# Altium schematic sheet [03] - USB-C TO DISPLAYPORT.SchDoc
size A3; DocumentNumber: 3; SheetNumber: 3; SheetTotal: 5
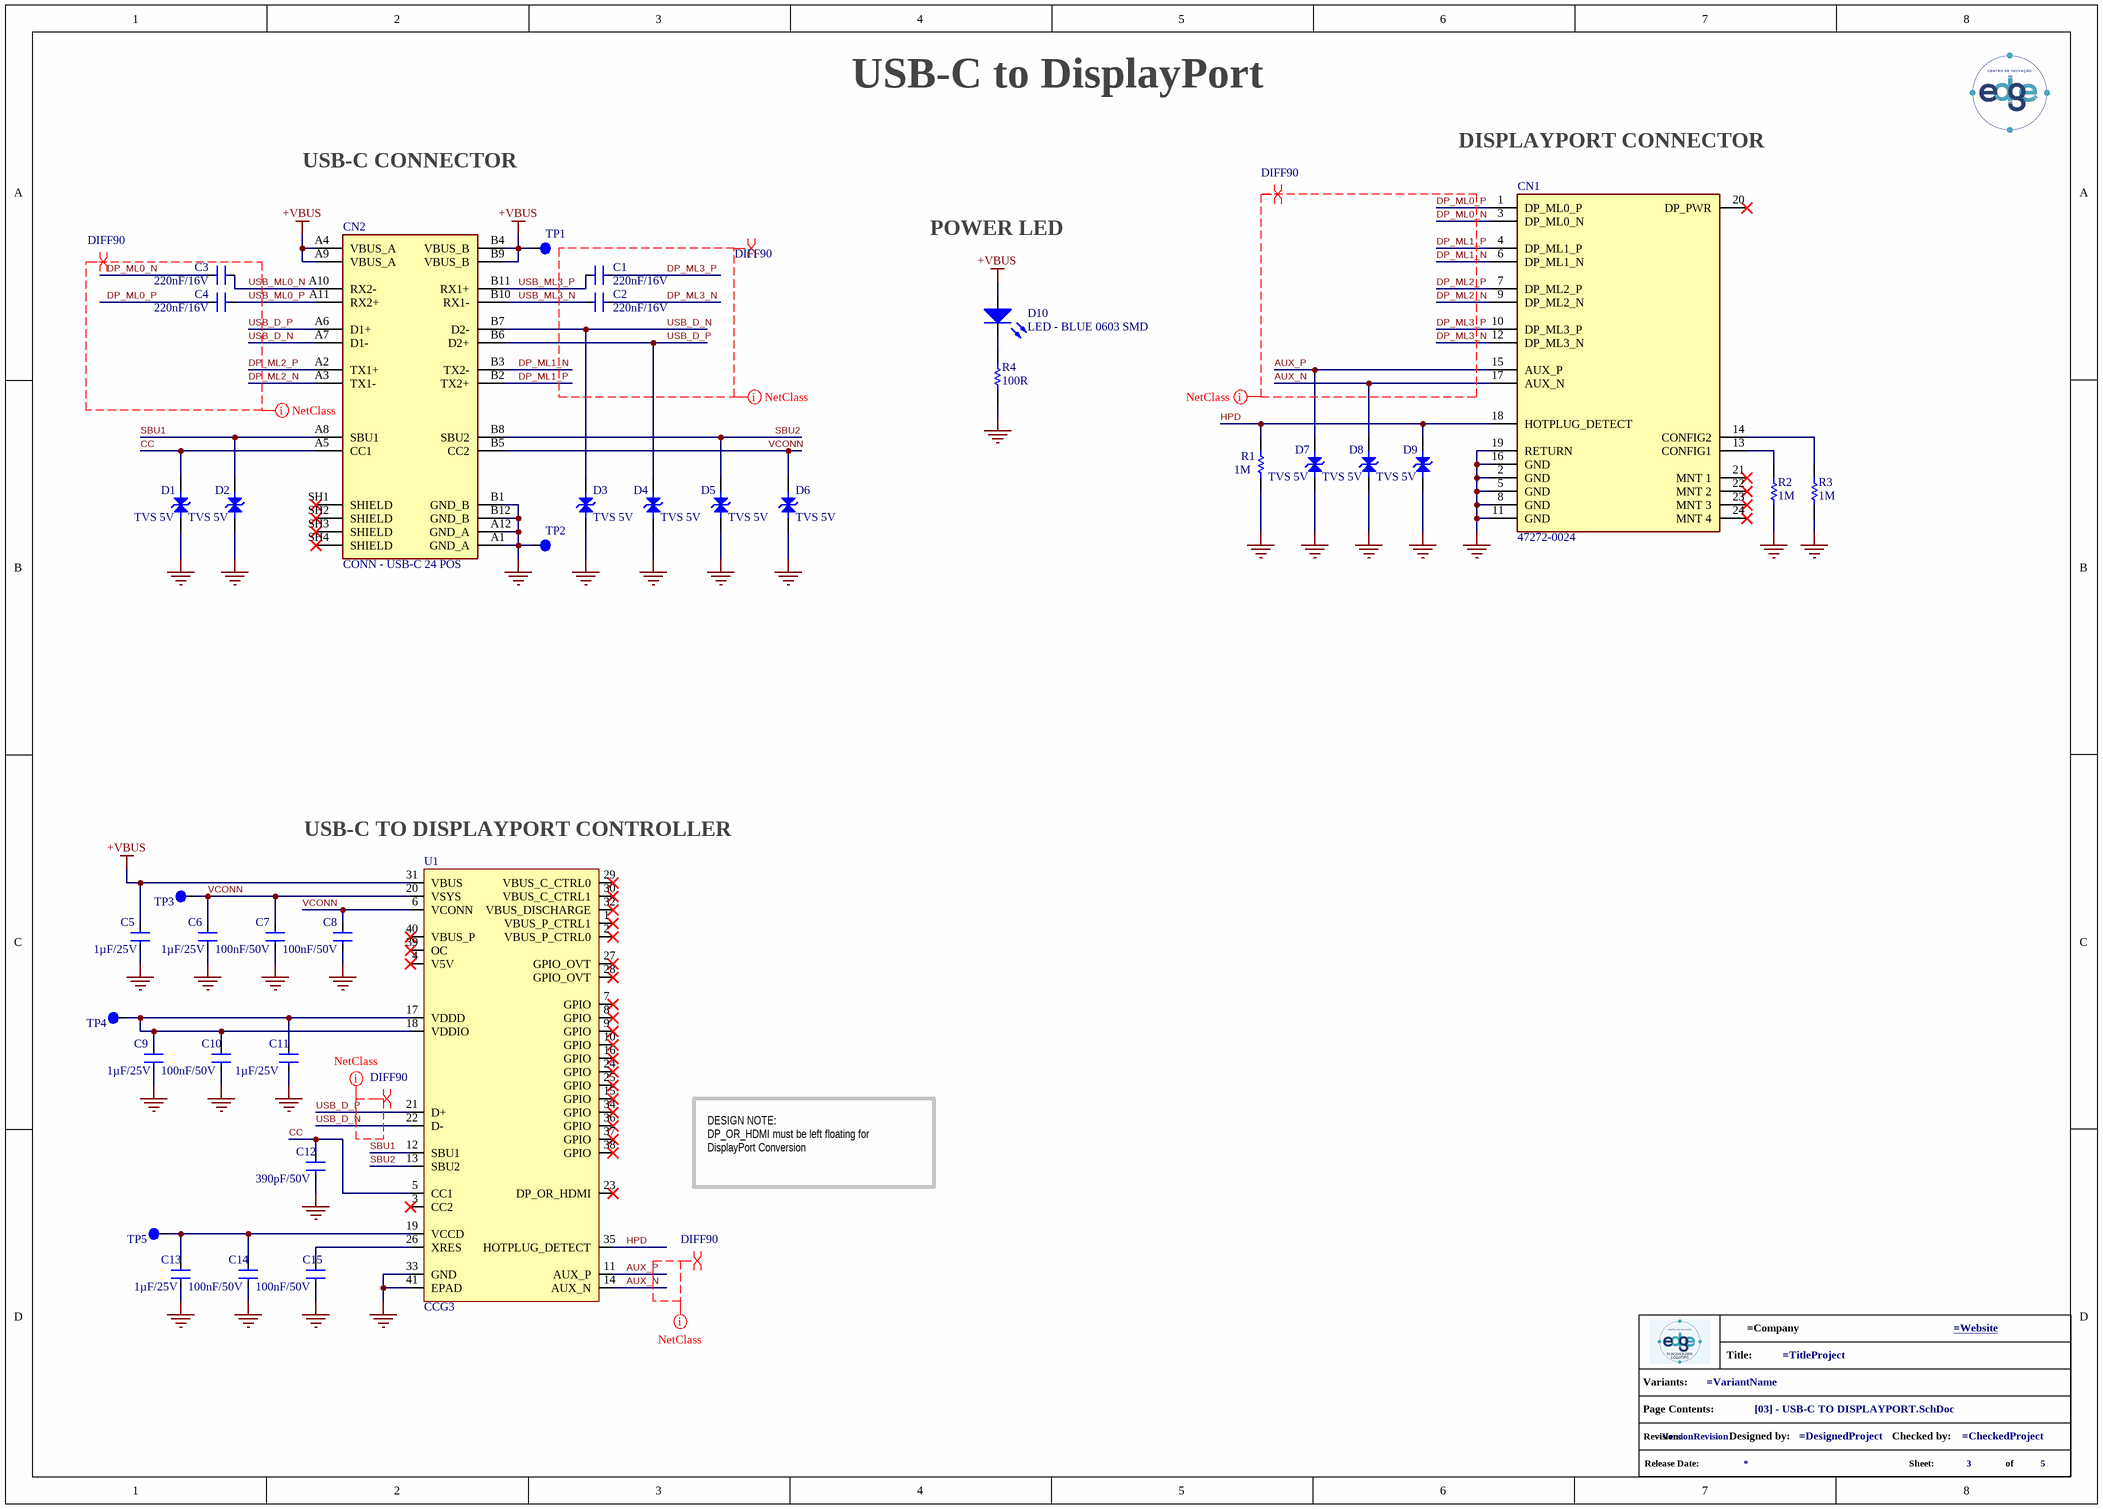
[diagram p0: [03] - USB-C TO DISPLAYPORT.SchDoc]

## Parts
*?  info_project  (value not drawn)  (graphical)
C1  220nF/16V  [C0402]
C2  220nF/16V  [C0402]
C3  220nF/16V  [C0402]
C4  220nF/16V  [C0402]
C5  1µF/25V  [C0402]
C6  1µF/25V  [C0402]
C7  100nF/50V  [C0402]
C8  100nF/50V  [C0402]
C9  1µF/25V  [C0402]
C10  100nF/50V  [C0402]
C11  1µF/25V  [C0402]
C12  390pF/50V  [C0402]
C13  1µF/25V  [C0402]
C14  100nF/50V  [C0402]
C15  100nF/50V  [C0402]
CN1  47272-0024  [FP-47272-0024-MFG]
CN2  CONN - USB-C 24 POS  [AMPHENOL_12401945E212A]
D1  TVS 5V  [STN161050U852]
D2  TVS 5V  [STN161050U852]
D3  TVS 5V  [STN161050U852]
D4  TVS 5V  [STN161050U852]
D5  TVS 5V  [STN161050U852]
D6  TVS 5V  [STN161050U852]
D7  TVS 5V  [STN161050U852]
D8  TVS 5V  [STN161050U852]
D9  TVS 5V  [STN161050U852]
D10  LED - BLUE 0603 SMD  [BLUE LED]
R1  1M  [R0402]
R2  1M  [R0402]
R3  1M  [R0402]
R4  100R  [R0402]
TP1  TestPoint  [Test Point]  (value not drawn)  (no BOM)
TP2  TestPoint  [Test Point]  (value not drawn)  (no BOM)
TP3  TestPoint  [Test Point]  (value not drawn)  (no BOM)
TP4  TestPoint  [Test Point]  (value not drawn)  (no BOM)
TP5  TestPoint  [Test Point]  (value not drawn)  (no BOM)
U1  CCG3  [QFN50P600X600X60_HS-41N]

## Nets
+VBUS: C5.2 CN2.A4(VBUS_A) CN2.A9(VBUS_A) CN2.B4(VBUS_B) CN2.B9(VBUS_B) D10.2(A) TP1.1 U1.31(VBUS)
GND: C5.1 C6.1 C7.1 C8.1 C9.1 C10.1 C11.1 C12.1 C13.1 C14.1 C15.1 CN1.2(GND) CN1.5(GND) CN1.8(GND) CN1.11(GND) CN1.16(GND) CN1.19(RETURN) CN2.A1(GND_A) CN2.A12(GND_A) CN2.B1(GND_B) CN2.B12(GND_B) D1.1 D2.1 D3.1 D4.1 D5.1 D6.1 D7.1 D8.1 D9.1 R1.1 R2.2 R3.2 R4.1 TP2.1 U1.33(GND) U1.41(EPAD)
AUX_N: CN1.17(AUX_N) D8.2 U1.14(AUX_N)
AUX_P: CN1.15(AUX_P) D7.2 U1.11(AUX_P)
CC: C12.2 CN2.A5(CC1) D1.2 U1.5(CC1)
DP_ML0_N: C3.1 CN1.3(DP_ML0_N)
DP_ML0_P: C4.1 CN1.1(DP_ML0_P)
DP_ML1_N: CN1.6(DP_ML1_N) CN2.B3(TX2-)
DP_ML1_P: CN1.4(DP_ML1_P) CN2.B2(TX2+)
DP_ML2_N: CN1.9(DP_ML2_N) CN2.A3(TX1-)
DP_ML2_P: CN1.7(DP_ML2_P) CN2.A2(TX1+)
DP_ML3_N: C2.2 CN1.12(DP_ML3_N)
DP_ML3_P: C1.2 CN1.10(DP_ML3_P)
HPD: CN1.18(HOTPLUG_DETECT) D9.2 R1.2 U1.35(HOTPLUG_DETECT)
SBU1: CN2.A8(SBU1) D2.2 U1.12(SBU1)
SBU2: CN2.B8(SBU2) D5.2 U1.13(SBU2)
USB_D_N: CN2.A7(D1-) CN2.B7(D2-) D3.2 U1.22(D-)
USB_D_P: CN2.A6(D1+) CN2.B6(D2+) D4.2 U1.21(D+)
USB_ML0_N: C3.2 CN2.A10(RX2-)
USB_ML0_P: C4.2 CN2.A11(RX2+)
USB_ML3_N: C2.1 CN2.B10(RX1-)
USB_ML3_P: C1.1 CN2.B11(RX1+)
VCONN: C6.2 C7.2 C8.2 CN2.B5(CC2) D6.2 TP3.1 U1.6(VCONN) U1.20(VSYS)
NetC9_2: C9.2 C10.2 C11.2 TP4.1 U1.17(VDDD) U1.18(VDDIO)
NetC13_2: C13.2 C14.2 TP5.1 U1.19(VCCD)
NetC15_2: C15.2 U1.26(XRES)
NetCN1_13: CN1.13(CONFIG1) R2.1
NetCN1_14: CN1.14(CONFIG2) R3.1
NetD10_1: D10.1(K) R4.2

Not connected (* = marked no-connect by the designer): CN1 20(DP_PWR)* 21(MNT_1)* 22(MNT_2)* 23(MNT_3)* 24(MNT_4)*; CN2 SH1(SHIELD)* SH2(SHIELD)* SH3(SHIELD)* SH4(SHIELD)*; U1 1(VBUS_P_CTRL1)* 2(VBUS_P_CTRL0)* 3(CC2)* 4(V5V)* 7(GPIO)* 8(GPIO)* 9(GPIO)* 10(GPIO)* 15(GPIO)* 16(GPIO)* 23(DP_OR_HDMI)* 24(GPIO)* 25(GPIO)* 27(GPIO_OVT)* 28(GPIO_OVT)* 29(VBUS_C_CTRL0)* 30(VBUS_C_CTRL1)* 32(VBUS_DISCHARGE)* 34(GPIO)* 36(GPIO)* 37(GPIO)* 38(GPIO)* 39(OC)* 40(VBUS_P)*

## Layout directives
differential pair; differential pair class DIFF90: (no net found under the mark), AUX_N, AUX_P, DP_ML0_N, DP_ML0_P, DP_ML1_N, DP_ML1_P, DP_ML2_N, DP_ML2_P, DP_ML3_N, DP_ML3_P, USB_D_N, USB_D_P, USB_ML0_N, USB_ML0_P
net class DIFF90: (no net found under the mark), AUX_N, AUX_P, DP_ML0_N, DP_ML0_P, DP_ML1_N, DP_ML1_P, DP_ML2_N, DP_ML2_P, DP_ML3_N, DP_ML3_P, USB_D_N, USB_D_P, USB_ML0_N, USB_ML0_P

## Notes on the sheet
- USB-C to DisplayPort
- USB-C CONNECTOR
- DISPLAYPORT CONNECTOR
- POWER LED
- (near U1) USB-C TO DISPLAYPORT CONTROLLER
- DESIGN NOTE:
  DP_OR_HDMI must be left floating for DisplayPort Conversion
- (in symbol info_project) Title:; Variants:; Page Contents:; Revision:; Designed by:; Checked by:; Release Date:; Sheet:; of

## Library data of the parts
C1-C4 = GCM155R71C224KE02D: MLCC - 220nF 16V 0402 X7R ±10%; Manufacturer: Murata; Dielectric Material: Ceramic; Multilayer: Yes; Reference Standard: AEC-Q200; Supplier: Future Electronics; Supplier Part Number: 7050660; Manufacturer Part Number: GCM155R71C224KE02D; RoHS: Yes; Category: Ceramic Capacitors; Stock: 70000; Pricing: 10000=0,0108, 30000=0,0105, 50000=0,0104, 150000=0,0101, 250000=0,0098 (USD); Mounting Technology: Surface Mount; Pins: 2; Package Shape: Rectangular; Case/Package: 0402; Terminal Finish: Nickel; Min Operating Temperature: -55°C; Max Operating Temperature: 125°C; JESD-609 Code: e3; Value: 220nF; Capacitor Type: Ceramic; Tolerance  (fill in as +-): 10%; Package Style: SMTMeter; Packaging: Tape and Reel; Tolerance (fill in as +-): 10%; Rated DC Voltage (URdc): 16V; Temperature Characteristics Code: X7R; Termination: Wraparound; Length: 1mm; Width: 0.5mm; Height: 0.55mm; Reach SVHC Compliant: Yes; RoHS Compliant: Yes; ComponentLink1URL: https://datasheet.ciiva.com:443/pdfs/VipMasterIC/IC/MURE/MURE-S-A0004370842/MURE-S-A0004372487-1.pdf?src-supplier=IHS+Markit; ComponentLink1Description: https://datasheet.ciiva.com:443/pdfs/VipMasterIC/IC/MURE/MURE-S-A0004370842/MURE-S-A0004372487-1.pdf?src-supplier=IHS+Markit; ComponentLink2URL: http://www.mouser.com/ds/2/281/c03e-806517.pdf?src-supplier=Mouser; ComponentLink2Description: http://www.mouser.com/ds/2/281/c03e-806517.pdf?src-supplier=Mouser; ComponentLink3URL: http://search.murata.co.jp/Ceramy/image/img/A01X/partnumbering_e_02.pdf?src-supplier=Digikey; ComponentLink3Description: http://search.murata.co.jp/Ceramy/image/img/A01X/partnumbering_e_02.pdf?src-supplier=Digikey; ComponentLink4URL: https://datasheet.octopart.com/GCM155R71C224KE02D-Murata-datasheet-32042419.pdf?src-supplier=Future+Electronics; ComponentLink4Description: https://datasheet.octopart.com/GCM155R71C224KE02D-Murata-datasheet-32042419.pdf?src-supplier=Future+Electronics; ComponentLink5URL: https://datasheet.octopart.com/GCM155R71C224KE02D-Murata-datasheet-149522429.pdf?src-supplier=Newark; ComponentLink5Description: https://datasheet.octopart.com/GCM155R71C224KE02D-Murata-datasheet-149522429.pdf?src-supplier=Newark; ComponentLink6URL: https://datasheet.octopart.com/GCM155R71C224KE02D-Murata-datasheet-12511495.pdf?src-supplier=TME; ComponentLink6Description: https://datasheet.octopart.com/GCM155R71C224KE02D-Murata-datasheet-12511495.pdf?src-supplier=TME
C5 C6 C9 C11 C13 = GRM155R61E105KA12D: MLCC - 1µF 25V 0402 X5R ±10%; Manufacturer 1: Murata; Material: Ceramic; Value: 1uF; .Mounting: SMT; .PCBChecked: Victor H; Supplier 1: Digikey; Manufacturer Part Number 1: GRM155R61E105KA12D; RoHS: Yes; Category: Ceramic Capacitors; Stock 1: 973671; Pricing 1: 1=0,1, 10=0,039, 50=0,0222, 100=0,0172, 500=0,01298, 1000=0,0102, 2500=0,00927, 5000=0,00853 (USD); Mounting Technology: Surface Mount; Case/Package: 0402; Case Code (Metric): 1005; Case Code (Imperial): 0402; Weight: 0.000212oz; Min Operating Temperature: -55°C; Max Operating Temperature: 85°C; Tolerance: 10%; Voltage Rating: 25V; Packaging: Cut Tape; Dielectric: X5R; Voltage: 25V; Termination: SMD/SMT; Voltage Rating (DC): 25V; Package Quantity: 10000; Series: GRM; Length: 1mm; Width: 0.5mm; Height: 0.5mm; Thickness: 0.022inch; Depth: 0.5mm; Reach SVHC Compliant: No; Lead Free: Lead Free; RoHS Compliant: Yes; ComponentLink1URL: https://datasheet.ciiva.com/7719/1666664-7719006.pdf?src-supplier=Element14; ComponentLink1Description: https://datasheet.ciiva.com/7719/1666664-7719006.pdf?src-supplier=Element14; ComponentLink2URL: https://datasheet.ciiva.com/22732/1666664-22732122.pdf?src-supplier=Element14; ComponentLink2Description: https://datasheet.ciiva.com/22732/1666664-22732122.pdf?src-supplier=Element14; Supplier Part Number 1: 490-10017-1-ND; .SCHChecked: Victor H
C7 C8 C10 C14 C15 = GRM155R71H104KE14J: MLCC - 100nF 50V 0402 X7R ±10%; Manufacturer 1: Murata; Material: 4241ConductorMaterial; .Mounting: SMT; .PCBChecked: Victor H; Supplier 1: Digikey; Manufacturer Part Number 1: GRM155R71H104KE14J; RoHS: Yes; Category: Ceramic Capacitors; Stock 1: 4903636; Pricing 1: 1=0,1, 10=0,026, 50=0,0148, 100=0,0115, 500=0,00866, 1000=0,0068, 2500=0,00618, 5000=0,00569 (USD); Mounting Technology: Surface Mount; Case/Package: 0402; Pins: 2NUMBER; Case Code (Metric): 1005; Case Code (Imperial): 0402; Weight: 0.000212oz; Min Operating Temperature: -55°C; Max Operating Temperature: 125°C; Packaging: Tape and Reel; Value: 100nF; Voltage Rating: 50V; Tolerance: 10%; Dielectric: X7R; Termination: SMD/SMT; Voltage Rating (DC): 50V; Package Quantity: 50000; Series: GRM; Length: 0.039inch; Width: 0.02inch; Height: 0.5mm; Thickness: 0.022inch; Lead Free: Lead Free; RoHS Compliant: Yes; ComponentLink1URL: https://datasheet.octopart.com/GRM155R71H104KE14J-Murata-datasheet-155345058.pdf?src-supplier=Element14; ComponentLink1Description: https://datasheet.octopart.com/GRM155R71H104KE14J-Murata-datasheet-155345058.pdf?src-supplier=Element14; ComponentLink2URL: http://search.murata.co.jp/Ceramy/image/img/A01X/G101/ENG/GRM155R71H104KE14-01.pdf?src-supplier=Digikey; ComponentLink2Description: http://search.murata.co.jp/Ceramy/image/img/A01X/G101/ENG/GRM155R71H104KE14-01.pdf?src-supplier=Digikey; ComponentLink3URL: https://datasheet.octopart.com/GRM155R71H104KE14J-Murata-datasheet-32479577.pdf?src-supplier=Future+Electronics; ComponentLink3Description: https://datasheet.octopart.com/GRM155R71H104KE14J-Murata-datasheet-32479577.pdf?src-supplier=Future+Electronics; ComponentLink4URL: http://search.murata.co.jp/Ceramy/image/img/A01X/G101/ENG/GRM155R71H104KE14-01.pdf?src-supplier=Mouser; ComponentLink4Description: http://search.murata.co.jp/Ceramy/image/img/A01X/G101/ENG/GRM155R71H104KE14-01.pdf?src-supplier=Mouser; ComponentLink5URL: http://search.murata.co.jp/Ceramy/image/img/A01X/G101/ENG/GRM155R71H104KE14-01.pdf?src-supplier=Avnet; ComponentLink5Description: http://search.murata.co.jp/Ceramy/image/img/A01X/G101/ENG/GRM155R71H104KE14-01.pdf?src-supplier=Avnet; ComponentLink6URL: https://datasheet.octopart.com/GRM155R71H104KE14J-Murata-datasheet-165579666.pdf?src-supplier=TME; ComponentLink6Description: https://datasheet.octopart.com/GRM155R71H104KE14J-Murata-datasheet-165579666.pdf?src-supplier=TME; Supplier Part Number 1: 490-13342-1-ND; .SCHChecked: Victor H
C12 = CL05B391KB5NNNC: MLCC - 390pF 50V 0402 X7R ±10%; Manufacturer: Samsung; Dielectric Material: Ceramic; Multilayer: Yes; Supplier: Digikey; Supplier Part Number: 1276-1560-1-ND; Manufacturer Part Number: CL05B391KB5NNNC; RoHS: Yes; Category: Ceramic Capacitors; Stock: 1329478; Pricing: 1=0,1, 10=0,023, 50=0,0132, 100=0,0102, 500=0,00766, 1000=0,00601, 2500=0,00547, 5000=0,00503 (USD); Mounting Technology: Surface Mount; Pins: 2; Package Shape: Rectangular; Case/Package: 0402; Terminal Finish: Nickel; Min Operating Temperature: -55°C; Max Operating Temperature: 125°C; JESD-609 Code: e3; Value: 390pF; Capacitor Type: Ceramic; Tolerance  (fill in as +-): 10%; Package Style: SMTMeter; Packaging: Tape and Reel; Tolerance (fill in as +-): 10%; Rated DC Voltage (URdc): 50V; Temperature Characteristics Code: X7R; Termination: Wraparound; Length: 1mm; Width: 0.5mm; Height: 0.55mm; Reach SVHC Compliant: Yes; RoHS Compliant: Yes; ComponentLink1URL: https://datasheet.ciiva.com:443/pdfs/VipMasterIC/IC/SEMS/SEMS-S-A0008384515/SEMS-S-A0008873249-1.pdf?src-supplier=IHS+Markit; ComponentLink1Description: https://datasheet.ciiva.com:443/pdfs/VipMasterIC/IC/SEMS/SEMS-S-A0008384515/SEMS-S-A0008873249-1.pdf?src-supplier=IHS+Markit; ComponentLink2URL: https://datasheet.ciiva.com/26838/getdatasheetpartid-660062-26838242.pdf?src-supplier=Verical; ComponentLink2Description: https://datasheet.ciiva.com/26838/getdatasheetpartid-660062-26838242.pdf?src-supplier=Verical; ComponentLink3URL: https://datasheet.ciiva.com/25738/cl05b391kb5nnnc-25738709.pdf?src-supplier=Digikey; ComponentLink3Description: https://datasheet.ciiva.com/25738/cl05b391kb5nnnc-25738709.pdf?src-supplier=Digikey; ComponentLink4URL: https://datasheet.ciiva.com/16202/cl05b104kq5nnnc-16202591.pdf?src-supplier=Future+Electronics; ComponentLink4Description: https://datasheet.ciiva.com/16202/cl05b104kq5nnnc-16202591.pdf?src-supplier=Future+Electronics
CN1 = 47272-0024: CONN - DisplayPort 20 POS; Manufacturer: Molex; Supplier: Mouser; Supplier Part Number: 538-47272-0024; Manufacturer Part Number: 47272-0024; RoHS: Yes; Category: Audio / Video Connectors; Stock: 4176; Pricing: 1=4,7, 10=4,31, 50=4,31, 100=3,71, 1000=2,96, 10000=2,86 (USD); ComponentLink1URL: https://datasheet.ciiva.com:443/pdfs/VipMasterIC/IC/MOLE/MOLE-S-A0003538154/MOLE-S-A0003534946-1.pdf?src-supplier=IHS+Markit; ComponentLink1Description: https://datasheet.ciiva.com:443/pdfs/VipMasterIC/IC/MOLE/MOLE-S-A0003538154/MOLE-S-A0003534946-1.pdf?src-supplier=IHS+Markit
CN2 = 12401945E212A: CONN - USB 3.1 TYPE C RECEPT TOP MNT DI; Manufacturer: Amphenol Communications Solutions; .Mounting: SMT; Supplier: Digikey; Supplier Part Number: 664-12401945E212ACT-ND; Manufacturer Part Number: 12401945E212A; RoHS: No; Stock: 11867; Pricing: 1=1,14, 10=0,994, 25=0,952, 50=0,931, 100=0,8886, 250=0,804, 500=0,74498 (USD); .SCHChecked: *; .PCBChecked: *
D1-D9 = CPDQT5V0HE-HF: TVS - DIODE ESD 5VWM 65W 0402/SOD-923F; Manufacturer: Comchip; .Mounting: SMT; Supplier: Digikey; Supplier Part Number: 641-CPDQT5V0HE-HFCT-ND; Manufacturer Part Number: CPDQT5V0HE-HF; RoHS: No; Stock: 4223; Pricing: 1=0,17, 10=0,149, 100=0,059, 500=0,04016, 1000=0,0352, 2000=0,03099, 5000=0,02642 (USD); .SCHChecked: *; .PCBChecked: *
D10 = 150060BS55040: Manufacturer: Wurth Electronics; Optoelectronic Device Type: SINGLE COLOR LED; Supplier: Digikey; Supplier Part Number: 732-12013-1-ND; Manufacturer Part Number: 150060BS55040; RoHS: Yes; Category: LEDs; Stock: 26973; Pricing: 1=0,18, 10=0,173, 100=0,157, 500=0,141, 1000=0,125 (USD); Reach SVHC Compliant: Yes; RoHS Compliant: Yes; ComponentLink1URL: https://datasheet.ciiva.com:443/pdfs/VipMasterIC/IC/MIDC/MIDC-S-A0006621110/MIDC-S-A0006621110-1.pdf?src-supplier=IHS+Markit; ComponentLink1Description: https://datasheet.ciiva.com:443/pdfs/VipMasterIC/IC/MIDC/MIDC-S-A0006621110/MIDC-S-A0006621110-1.pdf?src-supplier=IHS+Markit; ComponentLink2URL: http://www.farnell.com/datasheets/2621640.pdf?src-supplier=Farnell; ComponentLink2Description: http://www.farnell.com/datasheets/2621640.pdf?src-supplier=Farnell; ComponentLink3URL: https://www.we-online.de/web/en/index.php/download/media/07_electronic_components/download_center_1/application_notes_berichte/ano002_leds___the_future_of_horticultural_lighting/ANO002b_EN_LEDs_The_Future_of_Horticultural_Lighting.pdf?src-supplier=Digikey; ComponentLink3Description: https://www.we-online.de/web/en/index.php/download/media/07_electronic_components/download_center_1/application_notes_berichte/ano002_leds___the_future_of_horticultural_lighting/ANO002b_EN_LEDs_The_Future_of_Horticultural_Lighting.pdf?src-supplier=Digikey; ComponentLink4URL: http://www.farnell.com/datasheets/2621640.pdf?src-supplier=Newark; ComponentLink4Description: http://www.farnell.com/datasheets/2621640.pdf?src-supplier=Newark
R1-R3 = RC0402FR-071ML: RES - 1M 1/16W 0402 ±1%; Manufacturer: Yageo; Additional Feature: LASER TRIMMABLE; Power: 62.5mW; Rated Temperature: 70°C; Value: 1MR; Temperature Coefficient: 100ppm/°C; Working Voltage: 50V; Package Height: 0.35mm; Package Length: 1mm; Package Width: 0.5mm; Supplier: Future Electronics; Supplier Part Number: 9919234; Manufacturer Part Number: RC0402FR-071ML; RoHS: Yes; Category: Chip SMD Resistors; Stock: 1960000; Pricing: 10000=0,0015, 100000=0,0015, 300000=0,0014, 750000=0,0014, 2000000=0,0013 (USD); Mounting Technology: Surface Mount; Pins: 2; Package Shape: Rectangular; Case/Package: 0402; Terminal Finish: Nickel; Min Operating Temperature: -55°C; Max Operating Temperature: 155°C; Tolerance: 1%; JESD-609 Code: e3; Resistor Type: FIXED RESISTOR; Construction: Chip; Package Style: SMTMeter; Packaging: Tape and Reel; Technology: METAL GLAZE/THICK FILM; Termination: Wraparound; Reach SVHC Compliant: Yes; RoHS Compliant: Yes; ComponentLink1URL: https://datasheet.ciiva.com:443/pdfs/VipMasterIC/IC/YAGO/YAGO-S-A0008145938/YAGO-S-A0008145938-1.pdf?src-supplier=IHS+Markit; ComponentLink1Description: https://datasheet.ciiva.com:443/pdfs/VipMasterIC/IC/YAGO/YAGO-S-A0008145938/YAGO-S-A0008145938-1.pdf?src-supplier=IHS+Markit
R4 = RC0402FR-07100RL: RES - 100R 1/16W 0402 ±1%; Manufacturer: Yageo; Additional Feature: LASER TRIMMABLE; Power: 62.5mW; Rated Temperature: 70°C; Temperature Coefficient: 100ppm/°C; Working Voltage: 50V; Package Height: 0.35mm; Package Length: 1mm; Package Width: 0.5mm; Supplier: Digikey; Supplier Part Number: 311-100LRCT-ND; Manufacturer Part Number: RC0402FR-07100RL; RoHS: Yes; Category: Chip SMD Resistors; Stock: 3392441; Pricing: 1=0,1, 10=0,009, 50=0,0072, 100=0,0051, 500=0,00408, 1000=0,00306 (USD); Mounting Technology: Surface Mount; Pins: 2; Package Shape: Rectangular; Case/Package: 0402; Terminal Finish: Nickel; Min Operating Temperature: -55°C; Max Operating Temperature: 155°C; Tolerance: 1%; JESD-609 Code: e3; Resistor Type: FIXED RESISTOR; Construction: Chip; Packaging: Tape and Reel; Value: 100R; Technology: METAL GLAZE/THICK FILM; Termination: Wraparound; Reach SVHC Compliant: Yes; RoHS Compliant: Yes; ComponentLink1URL: https://datasheet.ciiva.com:443/pdfs/VipMasterIC/IC/YAGO/YAGO-S-A0008145938/YAGO-S-A0008145938-1.pdf?src-supplier=IHS+Markit; ComponentLink1Description: https://datasheet.ciiva.com:443/pdfs/VipMasterIC/IC/YAGO/YAGO-S-A0008145938/YAGO-S-A0008145938-1.pdf?src-supplier=IHS+Markit; ComponentLink2URL: https://datasheet.ciiva.com/11808/0900766b80c66297-11808765.pdf?src-supplier=Rs; ComponentLink2Description: https://datasheet.ciiva.com/11808/0900766b80c66297-11808765.pdf?src-supplier=Rs; ComponentLink3URL: https://datasheet.ciiva.com/7849/1784430-7849810.pdf?src-supplier=Element14; ComponentLink3Description: https://datasheet.ciiva.com/7849/1784430-7849810.pdf?src-supplier=Element14; ComponentLink4URL: https://datasheet.ciiva.com/16740/pyu-rc0402-51-rohs-l-6-r-16740566.pdf?src-supplier=Future+Electronics; ComponentLink4Description: https://datasheet.ciiva.com/16740/pyu-rc0402-51-rohs-l-6-r-16740566.pdf?src-supplier=Future+Electronics; ComponentLink5URL: https://datasheet.ciiva.com/12667/pyu-rc0402-51-rohs-l-6-r-12667957.pdf?src-supplier=Mouser; ComponentLink5Description: https://datasheet.ciiva.com/12667/pyu-rc0402-51-rohs-l-6-r-12667957.pdf?src-supplier=Mouser; ComponentLink6URL: https://datasheet.ciiva.com/22747/1018594-22747511.pdf?src-supplier=Element14; ComponentLink6Description: https://datasheet.ciiva.com/22747/1018594-22747511.pdf?src-supplier=Element14; ComponentLink7URL: https://datasheet.ciiva.com/28367/1018594-28367226.pdf?src-supplier=Element14; ComponentLink7Description: https://datasheet.ciiva.com/28367/1018594-28367226.pdf?src-supplier=Element14; ComponentLink8URL: https://datasheet.ciiva.com/15189/getdatasheetpartid-329466-15189335.pdf?src-supplier=Verical; ComponentLink8Description: https://datasheet.ciiva.com/15189/getdatasheetpartid-329466-15189335.pdf?src-supplier=Verical
TP1-TP5 = Test_Point: MECH - Test Points
U1 = CYPD3120-40LQXI: USB-C Controller (CCG3); Manufacturer: Infineon; Supplier: Digikey; Supplier Part Number: 448-CYPD3120-40LQXI-ND; Manufacturer Part Number: CYPD3120-40LQXI; RoHS: Yes; Stock: 2191; Pricing: 1=3,28, 10=2,401, 25=2,182, 80=2,1 (USD); Reach SVHC Compliant: Yes; RoHS Compliant: Yes